# EAGLE schematic sel-driver (EAGLE 6.6.0)
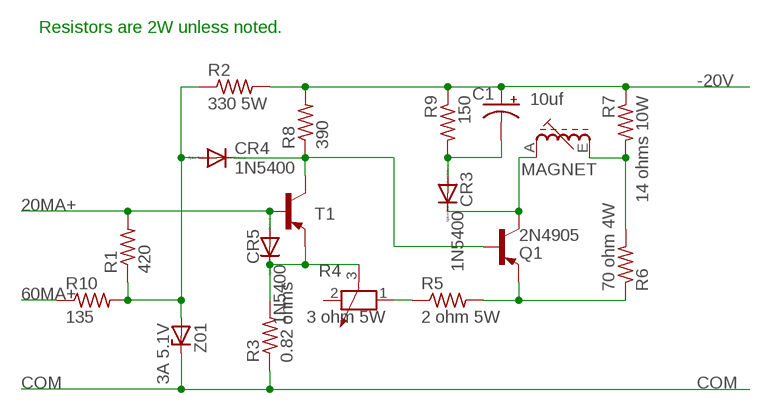
[diagram p0: schematic, sheet 1]

## Parts
C1  10uf  CPOL-US153CLV-1010  [153CLV-1010]
CR3  1N5400  [DO201-15]
CR4  1N5400  [DO201-15]
CR5  1N5400  [DO201-15]
MAGNET  71E  [71E]
Q1  2N4905  [TO3]
R1  420  R-US_0922/22  [0922/22]
R2  330 5W  R-US_0922/22  [0922/22]
R3  0.82 ohms  R-US_0922/22  [0922/22]
R4  3 ohm 5W  POTENTIOMETER_PT-10  [PT-10]
R5  2 ohm 5W  R-US_0922/22  [0922/22]
R6  70 ohm 4W  R-US_0922/22  [0922/22]
R7  14 ohms 10W  R-US_0922/22  [0922/22]
R8  390  R-US_0922/22  [0922/22]
R9  150  R-US_0922/22  [0922/22]
R10  135  R-US_0922/22  [0922/22]
T1  -PNP-TO5  [TO5]
Z01  3A 5.1V  1N5333  [C1702-15]

## Nets
20MA+: CR5.A R1.2 T1.2(B)
60MA+: R10.1
-20V: C1.+ R2.2 R7.1 R8.2 R9.1
COM: R3.1 Z01.C
N$1: CR4.A R1.1 R2.1 R10.2 Z01.A
N$2: MAGNET.E R6.2 R7.2
N$4: CR5.C R3.2 R4.3 T1.1(E)
N$5: R4.1 R5.1
N$6: Q1.E R5.2 R6.1
N$8: CR4.C Q1.B R8.1 T1.3(C)
N$9: CR3.C MAGNET.A Q1.C Q1.C/(C)
N$13: C1.- CR3.A R9.2
Unconnected: MAGNET.S1 MAGNET.S2 R4.2

## Notes on the sheet
- Resistors are 2W unless noted.

## Library data of the parts
C1 = rcl:CPOL-US: POLARIZED CAPACITOR, American symbol
CR3-CR5 = diode:1N5400: DIODE standard rectifier, 3 A, 50 V (Motorola)
MAGNET = inductor-neosid:71E: FILTER adjustable filter coil, Type E; OC_FARNELL: unknown; OC_NEWARK: unknown
Q1 = transistor-pnp:2N4905: PNP Transistor
R1-R3 R5-R10 = rcl:R-US_: RESISTOR, American symbol
R4 = rcl:POTENTIOMETER_: Potentiometer
T1 = transistor:*-PNP-: PNP Transistror
Z01 = diode:1N5333: Z DIODE 3.3 V, 5W, 5 percent (Motorola)